# Altium schematic sheet MCU.SchDoc
size 193 x 146 mm; DocumentNumber: 11; SheetNumber: 11; SheetTotal: 11
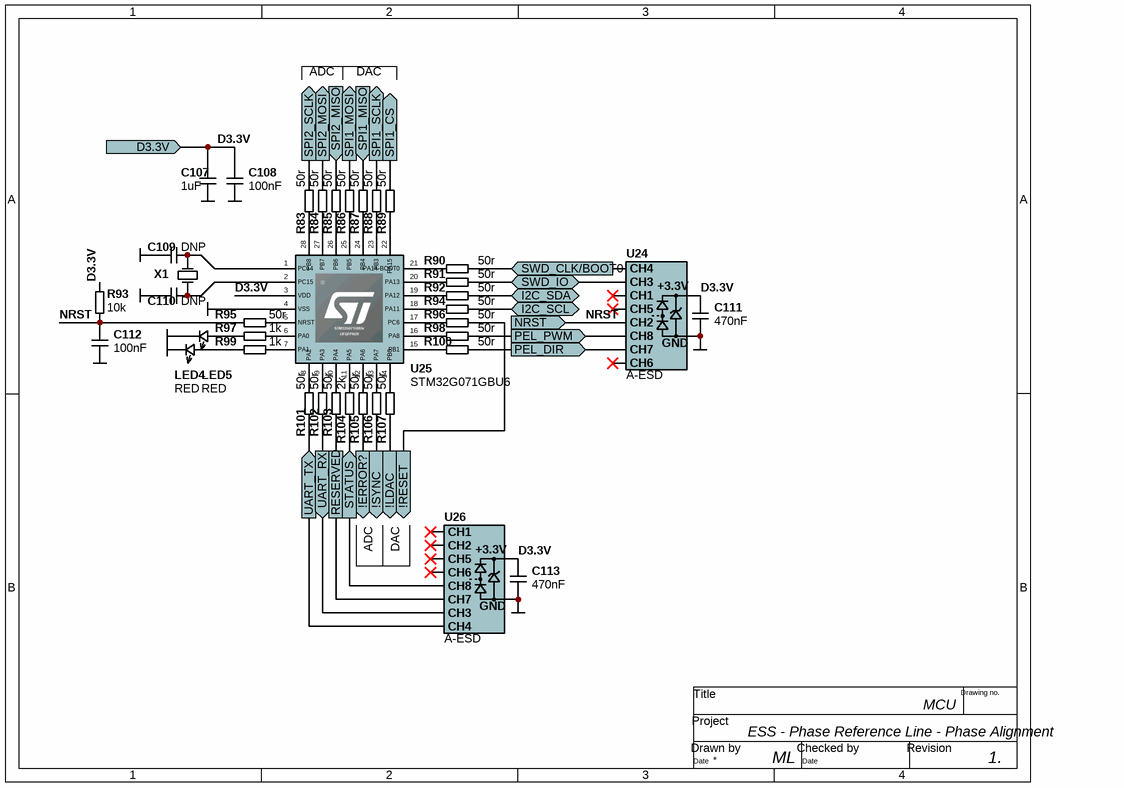
[diagram p0: MCU.SchDoc]

## Parts
C107  1uF  [0805-Capacitor]
C108  100nF  [0402-Capacitor]
C109  DNP  [0402-Capacitor]  (no BOM)
C110  DNP  [0402-Capacitor]  (no BOM)
C111  470nF  [0402-Capacitor]
C112  100nF  [0402-Capacitor]
C113  470nF  [0402-Capacitor]
LED4  RED  [LED0603]
LED5  RED  [LED0603]
R83  50r  [0402-RESISTOR]
R84  50r  [0402-RESISTOR]
R85  50r  [0402-RESISTOR]
R86  50r  [0402-RESISTOR]
R87  50r  [0402-RESISTOR]
R88  50r  [0402-RESISTOR]
R89  50r  [0402-RESISTOR]
R90  50r  [0402-RESISTOR]
R91  50r  [0402-RESISTOR]
R92  50r  [0402-RESISTOR]
R93  10k  [0402-RESISTOR]
R94  50r  [0402-RESISTOR]
R95  50r  [0402-RESISTOR]
R96  50r  [0402-RESISTOR]
R97  1k  [0402-RESISTOR]
R98  50r  [0402-RESISTOR]
R99  1k  [0402-RESISTOR]
R100  50r  [0402-RESISTOR]
R101  50r  [0402-RESISTOR]
R102  50r  [0402-RESISTOR]
R103  50r  [0402-RESISTOR]
R104  2k  [0402-RESISTOR]
R105  50r  [0402-RESISTOR]
R106  50r  [0402-RESISTOR]
R107  50r  [0402-RESISTOR]
U24  A-ESD  [MSOP10 3x3mm]
U25  STM32G071GBU6  [UFQFPN-28]
U26  A-ESD  [MSOP10 3x3mm]
X1  32.768KHz  [2-SMD-XTAL]  (value not drawn)

## Ports
!ERROR? (out), !LDAC (out), !RESET (out), !SYNC (out), D3.3V (in), I2C_SCL (bidir), I2C_SDA (bidir), NRST (in), PEL_DIR (out), PEL_PWM (out), RESERVED, SPI1_CS (out), SPI1_MISO (in), SPI1_MOSI (out), SPI1_SCLK (out), SPI2_MISO (in), SPI2_MOSI (out), SPI2_SCLK (out), STATUS (out), SWD_CLK/BOOT0 (in), SWD_IO (bidir), UART_RX (in), UART_TX (out)

## Nets
DGND: C107.2 C108.2 C109.1 C110.1 C111.2 C112.2 C113.2 LED4.K LED5.K U24.5(VN) U25.4(VSS) U26.5(VN)
!ERROR?: R105.1 ; port !ERROR?
!LDAC: R107.1 ; port !LDAC
!RESET: R96.1 ; port !RESET
!SYNC: R106.1 ; port !SYNC
D3.3V: C107.1 C108.1 C111.1 C113.1 R93.2 U24.8(VP) U25.3(VDD) U26.8(VP) ; port D3.3V
I2C_SCL: R94.1 ; port I2C_SCL
I2C_SDA: R92.1 ; port I2C_SDA
NRST: C112.1 R93.1 R95.2 U24.2(CH2) ; port NRST
PEL_DIR: R100.1 U24.9(CH7) ; port PEL_DIR
PEL_PWM: R98.1 U24.10(CH8) ; port PEL_PWM
RESERVED: R103.1 U26.9(CH7) ; port RESERVED
SPI1_CS: R89.1 ; port SPI1_CS
SPI1_MISO: R87.1 ; port SPI1_MISO
SPI1_MOSI: R86.1 ; port SPI1_MOSI
SPI1_SCLK: R88.1 ; port SPI1_SCLK
SPI2_MISO: R85.1 ; port SPI2_MISO
SPI2_MOSI: R84.1 ; port SPI2_MOSI
SPI2_SCLK: R83.1 ; port SPI2_SCLK
STATUS: R104.1 U26.10(CH8) ; port STATUS
SWD_CLK/BOOT0: R90.1 U24.4(CH4) ; port SWD_CLK/BOOT0
SWD_IO: R91.1 U24.3(CH3) ; port SWD_IO
UART_RX: R102.1 U26.3(CH3) ; port UART_RX
UART_TX: R101.1 U26.4(CH4) ; port UART_TX
NetC109_2: C109.2 U25.1(PC14) X1.2(OSC2)
NetC110_2: C110.2 U25.2(PC15) X1.1(OSC1)
NetLED4_A: LED4.A R99.1
NetLED5_A: LED5.A R97.1
NetR83_2: R83.2 U25.28(PB8)
NetR84_2: R84.2 U25.27(PB7)
NetR85_2: R85.2 U25.26(PB6)
NetR86_2: R86.2 U25.25(PB5)
NetR87_2: R87.2 U25.24(PB4)
NetR88_2: R88.2 U25.23(PB3)
NetR89_2: R89.2 U25.22(PA15)
NetR90_2: R90.2 U25.21(PA14-BOOT0)
NetR91_2: R91.2 U25.20(PA13)
NetR92_2: R92.2 U25.19(PA12)
NetR94_2: R94.2 U25.18(PA11)
NetR95_1: R95.1 U25.5(NRST)
NetR96_2: R96.2 U25.17(PC6)
NetR97_2: R97.2 U25.6(PA0)
NetR98_2: R98.2 U25.16(PA8)
NetR99_2: R99.2 U25.7(PA1)
NetR100_2: R100.2 U25.15(PB1)
NetR101_2: R101.2 U25.8(PA2)
NetR102_2: R102.2 U25.9(PA3)
NetR103_2: R103.2 U25.10(PA4)
NetR104_2: R104.2 U25.11(PA5)
NetR105_2: R105.2 U25.12(PA6)
NetR106_2: R106.2 U25.13(PA7)
NetR107_2: R107.2 U25.14(PB0)

Not connected (* = marked no-connect by the designer): U24 1(CH1)* 6(CH5)* 7(CH6)*; U26 1(CH1)* 2(CH2)* 6(CH5)* 7(CH6)*

## Notes on the sheet
- ADC
- DAC
- (near U26) DAC
- ESS - Phase Reference Line - Phase Alignment
- MCU
- ML
- 1.
- Title
- Project
- Drawing no.
- Date
- Drawn by
- Checked by
- Revision
- (in symbol CM1213-08MR) +3.3V; GND

## Library data of the parts
C107 = C_0805: Capacitor 0805; Tolerance: ±20%; Voltage Rating: 16V; Dielectric: X7R/C0G; Value: 1uF; Case: 0805
C108 C111-C113 = C_0402: Capacitor 0402; Tolerance: ±20%; Voltage Rating: 16V; Dielectric: X7R/C0G; Case: 0402
  C108 C112: Value: 100nF
  C111 C113: Value: 470nF
C109 C110 = C_0402: Capacitor 0402; Value: 4pF; Tolerance: ±20%; Voltage Rating: 16V; Dielectric: X7R/C0G; Case: 0402
LED4 LED5 = LED0603: Color: Red; Case: 0603
R83-R107 = R_0402: Resistor 0402; Tolerance: ±1%; Case: 0402
  R83-R92 R94-R96 R98 R100-R103 R105-R107: Value: 50r
  R93: Value: 10k
  R97 R99: Value: 1k
  R104: Value: 2k
U24 U26 = CM1213-08MR: 8-Channel / Low Capacitance ESD / Protection Array; HelpURL: https://www.onsemi.com/pub/Collateral/CM1213-D.PDF; Case: 10-MSOP; Supplier 1: Digi-Key; Supplier Part Number 1: CM1213-08MROSCT-ND
U25 = STM32G071GBU6: IC MCU 32BIT 128KB FLASH 28QFPN; HelpURL: https://media.digikey.com/pdf/Data%20Sheets/ST%20Microelectronics%20PDFS/STM32G071_Rev1_DS.pdf; Case: 28-UFQFPN; Supplier 1: Digi-Key; Supplier Part Number 1: 497-18343-ND
X1 = XTAL_ABS07-120-32.768KHZ-T: 32.768kHz ±20ppm Crystal 6pF 55 kOhms 2-SMD, No Lead; HelpURL: https://abracon.com/Resonators/ABS07-120-32.768kHz-T.pdf; Case: 2-SMD; Supplier 1: Digi-Key; Supplier Part Number 1: 535-11937-1-ND; Value: 32.768KHz